# EAGLE design powermeter (EAGLE 5.10)
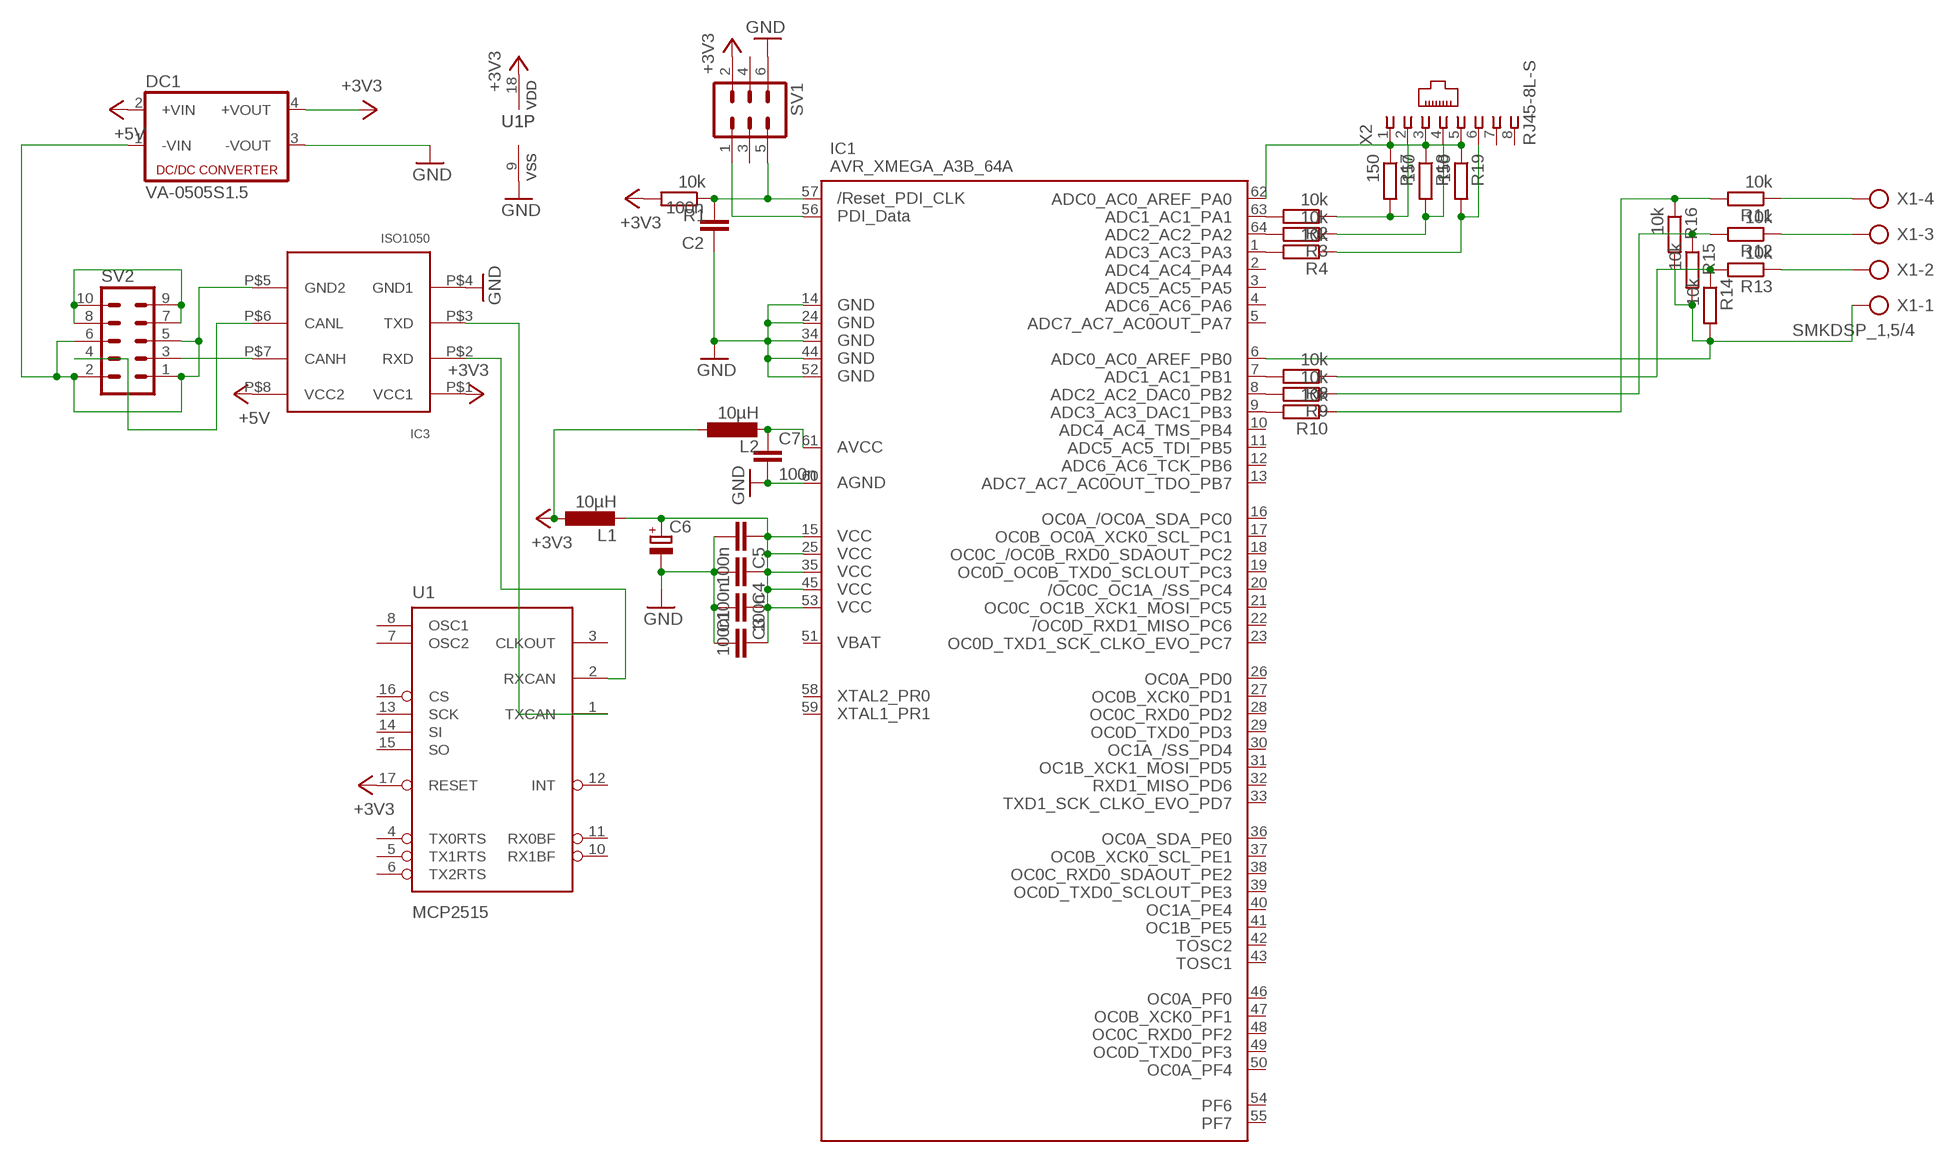
[diagram p0: schematic, sheet 1]

## Parts
C1  100n  C-EUC0805  [C0805]
C2  100n  C-EUC0805  [C0805]
C3  100n  C-EUC0805  [C0805]
C4  100n  C-EUC0805  [C0805]
C5  100n  C-EUC0805  [C0805]
C6  CPOL-EUSMCB  [SMC_B]
C7  100n  C-EUC0805  [C0805]
DC1  VA-0505S1.5  [4SIL]
IC1  AVR_XMEGA_A3B_64A  [TQFP64]
IC3  ISO1050  [DUB(R-PDSO-G8)]
L1  10µH  L-EUL3225M  [L3225M]
L2  10µH  L-EUL3225M  [L3225M]
R1  10k  R-EU_M0805  [M0805]
R2  10k  R-EU_M0805  [M0805]
R3  10k  R-EU_M0805  [M0805]
R4  10k  R-EU_M0805  [M0805]
R8  10k  R-EU_M0805  [M0805]
R9  10k  R-EU_M0805  [M0805]
R10  10k  R-EU_M0805  [M0805]
R11  10k  R-EU_M0805  [M0805]
R12  10k  R-EU_M0805  [M0805]
R13  10k  R-EU_M0805  [M0805]
R14  10k  R-EU_M0805  [M0805]
R15  10k  R-EU_M0805  [M0805]
R16  10k  R-EU_M0805  [M0805]
R17  150  R-EU_M0805  [M0805]
R18  150  R-EU_M0805  [M0805]
R19  150  R-EU_M0805  [M0805]
SV1  ML6  [ML6]
SV2  ML10L  [ML10L]
U1  MCP2515  [SO18W_LONG]
X1  SMKDSP_1,5/4  [SMKDSP_1,5/4]
X2  RJ45-8L-S  [RJ45-NO-SHIELD]

## Nets
+3V3: DC1.4(+VOUT) IC3.P$1(VCC1) L1.1 L2.1 R1.2 SV1.2 U1.17(RESET) U1.18(VDD)
+5V: DC1.2(+VIN) IC3.P$8(VCC2)
GND: C1.1 C2.1 C3.2 C4.2 C5.2 C6.- C7.2 DC1.3(-VOUT) IC1.14(GND1) IC1.24(GND2) IC1.34(GND3) IC1.44(GND4) IC1.52(GND5) IC1.60(AGND) IC3.P$4(GND1) SV1.6 U1.9(VSS)
GND2: DC1.1(-VIN) IC3.P$5(GND2) SV2.1 SV2.2 SV2.5 SV2.6
N$1: C2.2 IC1.57(RESET) R1.1 SV1.5
N$2: C1.2 C3.1 C4.1 C5.1 C6.+ IC1.15(VCC1) IC1.25(VCC2) IC1.35(VCC3) IC1.45(VCC4) IC1.53(VCC5) L1.2
N$3: IC1.63(PA1) R2.2
N$4: IC1.64(PA2) R3.2
N$5: IC1.1(PA3) R4.2
N$6: C7.1 IC1.61(AVCC) L2.2
N$7: IC3.P$2(RXD) U1.2(RXCAN)
N$8: IC3.P$3(TXD) U1.1(TXCAN)
N$9: IC1.7(PB1) R8.2
N$10: IC1.8(PB2) R9.2
N$11: IC1.9(PB3) R10.2
N$12: R8.1 R13.2 R14.1
N$13: R9.1 R12.2 R15.1
N$14: R10.1 R11.2 R16.1
N$16: R13.1 X1.2
N$17: R12.1 X1.3
N$18: R11.1 X1.4
N$19: IC1.56(PDI_DATA) SV1.1
N$21: IC3.P$6(CANL) SV2.4
N$23: IC3.P$7(CANH) SV2.3
N$26: IC1.62(PA0) R17.1 R18.1 R19.1 X2.1 X2.3 X2.5
N$27: SV2.7 SV2.8 SV2.9 SV2.10
N$28: R2.1 R17.2 X2.2
N$29: R3.1 R18.2 X2.4
N$30: R4.1 R19.2 X2.6
VGND: IC1.6(PB0) R14.2 R15.2 R16.2 X1.1
Unconnected: IC1.2(PA4) IC1.3(PA5) IC1.4(PA6) IC1.5(PA7) IC1.10(PB4) IC1.11(PB5) IC1.12(PB6) IC1.13(PB7) IC1.16(PC0) IC1.17(PC1) IC1.18(PC2) IC1.19(PC3) IC1.20(PC4) IC1.21(PC5) IC1.22(PC6) IC1.23(PC7) IC1.26(PD0) IC1.27(PD1) IC1.28(PD2) IC1.29(PD3) IC1.30(PD4) IC1.31(PD5) IC1.32(PD6) IC1.33(PD7) IC1.36(PE0) IC1.37(PE1) IC1.38(PE2) IC1.39(PE3) IC1.40(PE4) IC1.41(PE5) IC1.42(TOSC2) IC1.43(TOSC1) IC1.46(PF0) IC1.47(PF1) IC1.48(PF2) IC1.49(PF3) IC1.50(PF4) IC1.51(VBAT) IC1.54(PF6) IC1.55(PF7) IC1.58(PR0) IC1.59(PR1) SV1.3 SV1.4 U1.3(CLKOUT) U1.4(TX0RTS) U1.5(TX1RTS) U1.6(TX2RTS) U1.7(OSC2) U1.8(OSC1) U1.10(RX1BF) U1.11(RX0BF) U1.12(INT) U1.13(SCK) U1.14(SI) U1.15(SO) U1.16(CS) X2.7 X2.8

## Library data of the parts
C1-C5 C7 = rcl:C-EU: CAPACITOR, European symbol
C6 = rcl:CPOL-EU: POLARIZED CAPACITOR, European symbol
DC1 = dc-dc-converter:VA-*?: DC DC Converter Single Output, 1 Watt Motien Technology Co.,Ltd. Source: va-serie.pdf
IC1 = xmega:AVR_XMEGA_A3B_: Device for Atmel AVR XMEGA A3B Series
IC3 = at90usb162:ISO1050: ISO1050 Isolated CAN TRANSCEIVER FEATURES 5000-VRMS Isolation (DW Package) 2500-VRMS Isolation (DUB Package) Failsafe Outputs Low Loop Delay: 150 ns Typical 50 kV/ms Typical Transient Immunity Meets or Exceeds ISO 11898 requirements Bus-Fault Protection of ?27 V to 40 V Dominant Time-Out Function IEC 60747-5-2 (VDE 0884, Rev. 2) & IEC 61010-1 Approved UL 1577, IEC 60950-1 and CSA Approvals Pending 3.3-V Inputs are 5-V Tolerant
L1 L2 = rcl:L-EU: INDUCTOR, European symbol
R1-R4 R8-R19 = rcl:R-EU_: RESISTOR, European symbol
SV1 = con-ml:ML6: HARTING
SV2 = con-ml:ML10L: HARTING
U1 = untitled:MCP2515
X1 = con-phoenix-smkdsp:SMKDSP_1,5/4: Printklemme, Nennstrom: 17,5 A, Bemessungsspannung: 250 V, Raster: 5,0 mm Source: http://eshop.phoenixcontact.de .. 1733415.pdf
X2 = con-tycoelectronics:RJ45: CORCOM Modular RJ Jacks No Shield Source: www.tycoelectronics.com .. ENG_DS_1654001_1099_RJ_L_0507.pdf

## Board
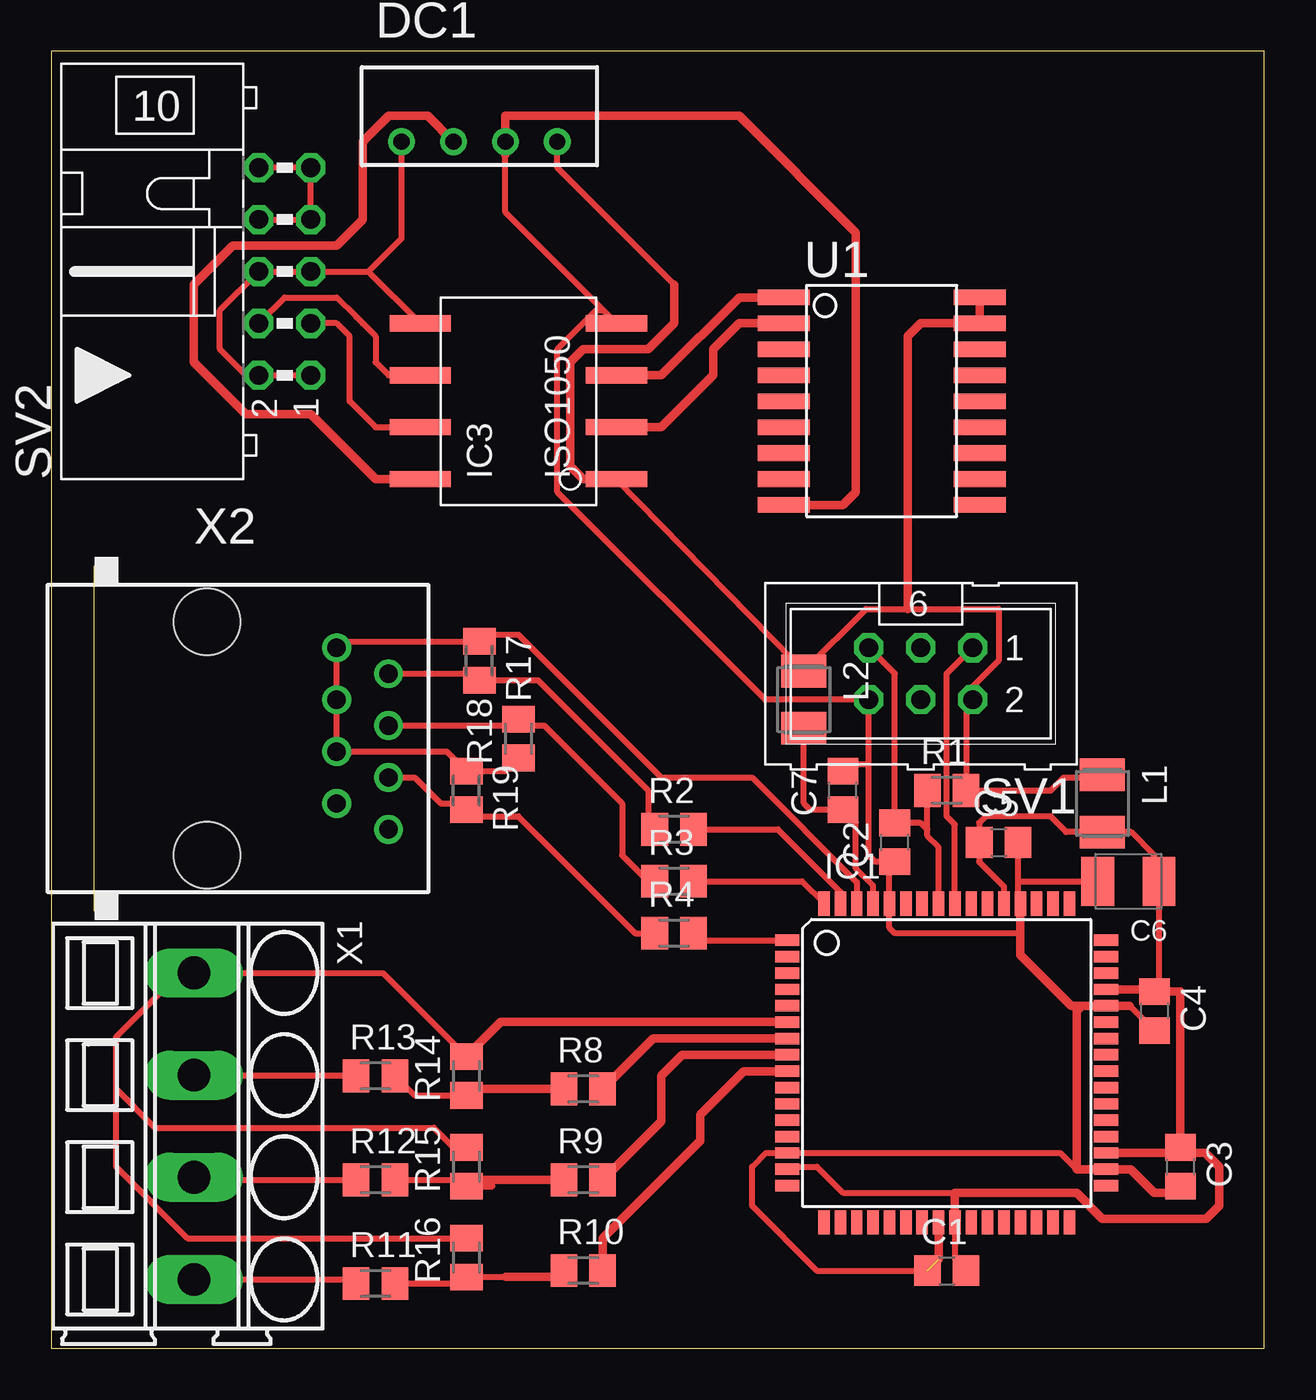
[diagram p1: board, top side]

Size 59.36 x 63.49 mm. Coordinates in mm from the lower left corner, seen from the top.
Outline: 0,0 59.36,0 59.36,63.49 0,63.49 0,0
Copper layers (1*16): Top 0.035mm / dielectric 1.5mm / Bottom 0.035mm
Design rules "default": minimum track width 10mil, minimum drill 24mil, track to track 8mil, track to pad 8mil, pad to pad 8mil, via to via 8mil, smd to smd 8mil, copper to edge 40mil, drill to drill 8mil, minimum pad ring 10mil, minimum via ring 8mil, stop-mask expansion 4mil, vias tented up to drill 0mil, thermal gap 10mil

### Footprints (pad centres in the part's own frame; a part is rotated, then mirrored left to right if it is on the bottom)
C0805 = smd 1.3 x 1.5: 1 -0.95,0; 2 0.95,0
SMC_B = smd 1.6 x 2.4: + -1.5,0; - 1.5,0
4SIL = drill 0.8 round: 1 -3.81,0; 2 -1.27,0; 3 1.27,0; 4 3.81,0
TQFP64 = smd 1.194 x 0.559: 1 -7.8,6; 2 -7.8,5.2; 3 -7.8,4.4; 4 -7.8,3.6; 5 -7.8,2.8; 6 -7.8,2; 7 -7.8,1.2; 8 -7.8,0.4; 9 -7.8,-0.4; 10 -7.8,-1.2; 11 -7.8,-2; 12 -7.8,-2.8; 13 -7.8,-3.6; 14 -7.8,-4.4; 15 -7.8,-5.2; 16 -7.8,-6; 33 7.8,-6; 34 7.8,-5.2; 35 7.8,-4.4; 36 7.8,-3.6; 37 7.8,-2.8; 38 7.8,-2; 39 7.8,-1.2; 40 7.8,-0.4; 41 7.8,0.4; 42 7.8,1.2; 43 7.8,2; 44 7.8,2.8; 45 7.8,3.6; 46 7.8,4.4; 47 7.8,5.2; 48 7.8,6 | smd 0.559 x 1.194: 17 -6,-7.8; 18 -5.2,-7.8; 19 -4.4,-7.8; 20 -3.6,-7.8; 21 -2.8,-7.8; 22 -2,-7.8; 23 -1.2,-7.8; 24 -0.4,-7.8; 25 0.4,-7.8; 26 1.2,-7.8; 27 2,-7.8; 28 2.8,-7.8; 29 3.6,-7.8; 30 4.4,-7.8; 31 5.2,-7.8; 32 6,-7.8; 49 6,7.8; 50 5.2,7.8; 51 4.4,7.8; 52 3.6,7.8; 53 2.8,7.8; 54 2,7.8; 55 1.2,7.8; 56 0.4,7.8; 57 -0.4,7.8; 58 -1.2,7.8; 59 -2,7.8; 60 -2.8,7.8; 61 -3.6,7.8; 62 -4.4,7.8; 63 -5.2,7.8; 64 -6,7.8
DUB(R-PDSO-G8) = smd 0.8 x 3: P$1 -3.81,-4.8; P$2 -1.27,-4.8; P$3 1.27,-4.8; P$4 3.81,-4.8; P$5 3.81,4.8; P$6 1.27,4.8; P$7 -1.27,4.8; P$8 -3.81,4.8
L3225M = smd 1.6 x 2.2: 1 -1.4,0; 2 1.4,0
M0805 = smd 1.3 x 1.6: 1 -0.95,0; 2 0.95,0
ML6 = drill 0.914 octagon: 1 -2.54,-1.27; 2 -2.54,1.27; 3 0,-1.27; 4 0,1.27; 5 2.54,-1.27; 6 2.54,1.27
ML10L = drill 0.914 octagon: 1 -5.08,-1.27; 2 -5.08,1.27; 3 -2.54,-1.27; 4 -2.54,1.27; 5 0,-1.27; 6 0,1.27; 7 2.54,-1.27; 8 2.54,1.27; 9 5.08,-1.27; 10 5.08,1.27
SO18W_LONG = smd 0.762 x 2.54: 1 -5.08,-4.788; 2 -3.81,-4.788; 3 -2.54,-4.788; 4 -1.27,-4.788; 5 0,-4.788; 6 1.27,-4.788; 7 2.54,-4.788; 8 3.81,-4.788; 9 5.08,-4.788; 10 5.08,4.788; 11 3.81,4.788; 12 2.54,4.788; 13 1.27,4.788; 14 0,4.788; 15 -1.27,4.788; 16 -2.54,4.788; 17 -3.81,4.788; 18 -5.08,4.788
SMKDSP_1,5/4 = drill 1.6 pad 1.8 long: 1 -2.5,0; 2 2.5,0; 3 7.5,0; 4 12.5,0
RJ45-NO-SHIELD = drill 0.9 pad 1.4 round: 1 -4.445,6.35; 2 -3.175,8.89; 3 -1.905,6.35; 4 -0.635,8.89; 5 0.635,6.35; 6 1.905,8.89; 7 3.175,6.35; 8 4.445,8.89 | hole 3.251: -5.715,0; 5.715,0

### Placement (x,y rotation side)
C1  43.81,3.81 0 top
C2  41.27,24.77 90 top
C3  55.24,8.89 270 top
C4  53.98,16.51 270 top
C5  46.35,24.77 0 top
C6  52.7,22.86 180 top
C7  38.73,27.3 90 top
DC1  20.95,59.05 0 top
IC1  43.81,13.97 0 top
IC3  22.86,46.35 90 top
L1  51.44,26.67 270 top
L2  36.83,31.75 270 top
R1  43.81,27.3 0 top
R2  30.48,25.4 0 top
R3  30.48,22.86 0 top
R4  30.48,20.32 0 top
R8  26.04,12.7 0 top
R9  26.04,8.26 0 top
R10  26.04,3.81 0 top
R11  15.88,3.17 0 top
R12  15.88,8.26 0 top
R13  15.88,13.34 0 top
R14  20.32,13.34 90 top
R15  20.32,8.89 90 top
R16  20.32,4.45 90 top
R17  20.95,33.66 270 top
R18  22.86,29.84 90 top
R19  20.32,27.3 270 top
SV1  42.55,33.02 180 top
SV2  11.43,52.7 90 top
U1  40.64,46.35 270 top
X1  6.99,15.88 270 top
X2  7.62,29.84 270 top

### Tracks (layer width: path | path; a pad name or v marks a point on that pad's centre or on a via)
+3V3
  Top 0.305: L1.1 51.3,27.94 49.53,27.94 48.9,27.3 R1.2 44.77,31.43 SV1.2 45.09,32.38 46.35,33.66 46.35,36.2 41.91,36.2 39.88,36.2 L2.1 36.33,33.66 IC3.P$1 | DC1.4 24.77,57.78 30.48,52.07
  Top 0.406: 30.48,52.07 30.48,50.16 29.21,48.9 26.04,48.9 25.4,48.26 25.4,43.18 26.04,42.55 IC3.P$1 | U1.18 U1.17 42.55,50.16 41.91,49.53 41.91,36.2
+5V
  Top 0.406: DC1.2 18.41,60.33 16.51,60.33 15.24,59.05 15.24,55.24 13.97,53.98 8.89,53.98 6.99,52.07 6.99,48.26 9.53,45.72 12.7,45.72 15.88,42.55 IC3.P$8
GND  (1 unrouted)
  Top 0.305: 52.77,16.77 C4.2 | 47.41,20.32 41.27,20.32 41.02,20.58 IC1.60 41.02,23.55 C2.1 40.32,23.82 40.01,24.13 40.01,28.57 | IC1.52 47.3,21.88 47.3,22.86 | 47.3,22.86 C5.2 | 47.3,22.86 C6.- | 40.01,28.57 SV1.6 34.92,31.75 24.77,41.91 24.77,48.9 26.67,50.8 27.02,50.8 IC3.P$4 22.23,55.6 22.23,58.42 DC1.3 | C1.1 37.47,3.81 34.29,6.99 34.29,8.89 34.97,9.57 IC1.14 49.37,9.57 50.16,8.77 | 54.92,7.62 C3.2 | C7.2 39.05,28.57 40.01,28.57
  Top 0.406: 54.92,7.62 53.98,7.62 52.83,8.77 IC1.34 50.16,8.77 50.16,16.51 50.42,16.77 IC1.44 | IC1.52 47.41,20.32 47.41,19.26 49.91,16.77 IC1.44 | 43.41,4.36 IC1.24 | IC1.44 52.77,16.77 | U1.9 38.73,41.27 39.37,41.91 39.37,54.61 33.66,60.33 22.23,60.33 22.23,58.42
GND2
  Top 0.305: SV2.1 SV2.2 9.53,47.62 8.26,48.9 8.26,50.8 SV2.6 SV2.5 15.52,52.7 | 15.52,52.7 IC3.P$5 | 15.52,52.7 17.14,54.33 DC1.1
N$1
  Top 0.305: SV1.5 41.27,33.02 C2.2 42.55,25.71 42.87,25.4 | IC1.57 43.41,24.53 42.87,25.08 42.87,25.4 | 42.87,25.4 R1.1
N$2
  Top 0.305: IC1.53 46.62,22.6 45.41,23.81 C5.1 45.41,25.72 45.72,26.04 48.9,26.04 49.66,25.27 L1.2 52.84,25.27 53.98,24.13 53.98,23.09 C6.+ 54.2,17.69 C4.1 | 44.22,7.62 38.73,7.62 37.47,8.89 36.13,8.89 IC1.15 | IC1.25 44.22,4.36 C1.2
  Top 0.406: IC1.25 44.22,7.62 50.16,7.62 51.44,6.35 56.52,6.35 57.15,6.99 57.15,8.89 56.47,9.57 55.52,9.57 C3.1 | IC1.45 53.98,17.57 C4.1 55.24,17.46 C3.1 | IC1.35 54.98,9.57 C3.1
N$3
  Top 0.305: IC1.63 38.62,22.34 35.56,25.4 R2.2
N$4
  Top 0.305: IC1.64 36.73,22.86 R3.2
N$5
  Top 0.305: IC1.1 31.78,19.97 R4.2
N$6
  Top 0.305: IC1.61 40.22,22.65 39.37,23.5 39.37,25.72 C7.1 37.15,26.36 36.83,26.67 L2.2
N$7
  Top 0.406: U1.2 33.66,50.16 32.38,48.9 32.38,47.62 29.84,45.09 IC3.P$2
N$8
  Top 0.406: IC3.P$3 29.84,47.62 33.66,51.44 U1.1
N$9
  Top 0.406: IC1.7 29.45,15.17 R8.2
N$10
  Top 0.406: IC1.8 30.88,14.37 29.84,13.34 29.84,11.12 R9.2
N$11
  Top 0.406: R10.2 26.98,5.39 31.75,10.16 31.75,11.43 33.89,13.57 IC1.9
N$12
  Top 0.305: R13.2 17.77,12.38 R14.1
  Top 0.406: R14.1 20.64,12.7 R8.1
N$13
  Top 0.305: R12.2 20,8.26 R15.1 21.59,7.94
  Top 0.406: R9.1 20.64,8.26 R15.1
N$14
  Top 0.305: R11.2 20,3.17 R16.1 22.23,3.5
  Top 0.406: 22.23,3.5 25.09,3.5 25.4,3.81 R10.1
N$16
  Top 0.305: X1.2 14.88,13.38 R13.1
N$17
  Top 0.305: R12.1 7.11,8.26 X1.3
N$18
  Top 0.305: X1.4 14.72,3.38 R11.1
N$19
  Top 0.305: IC1.56 44.22,25.64 43.81,26.04 43.81,33.02 SV1.1
N$21
  Top 0.305: IC3.P$6 16.51,47.62 15.88,48.26 15.88,49.53 15.24,50.16 14.92,50.48 13.97,51.44 11.43,51.44 SV2.4
N$23
  Top 0.305: IC3.P$7 15.88,45.09 14.61,46.35 14.61,49.53 13.97,50.16 SV2.3
N$26
  Top 0.305: R18.1 22.22,28.25 R19.1 19.36,29.21 X2.5 X2.3 X2.1 14.29,34.6 R17.1 21.27,34.92 22.86,34.92 23.5,34.29 24.13,33.66 29.84,27.94 34.29,27.94 39.41,22.82 IC1.62
N$27
  Top 0.305: SV2.9 SV2.10 | SV2.9 9.53,57.78 | SV2.9 SV2.7 SV2.8
N$28
  Top 0.305: X2.2 20.64,33.02 R17.2 23.81,32.7 29.21,27.3 29.21,25.72 R2.1
N$29
  Top 0.305: X2.4 22.55,30.48 | 22.55,30.48 R18.2 | 22.55,30.48 24.13,30.48 27.94,26.67 27.94,24.13 29.21,22.86 R3.1
N$30
  Top 0.305: X2.6 17.78,27.94 19.05,26.67 20,26.67 R19.2 20.64,26.04 22.86,26.04 28.57,20.32 R4.1
VGND
  Top 0.305: 3.17,12.7 3.17,15.24 6.31,18.38 X1.1 16.23,18.38 R14.2 | 3.17,12.7 5.08,10.79 18.73,10.79 19.68,9.84 R15.2 | R16.2 6.67,5.39 3.17,8.89 3.17,12.7
  Top 0.406: R14.2 22,15.97 IC1.6